# Altium schematic sheet MANEA_TCAD_PROIECT_Sheet2.SchDoc (part 2 of 3)
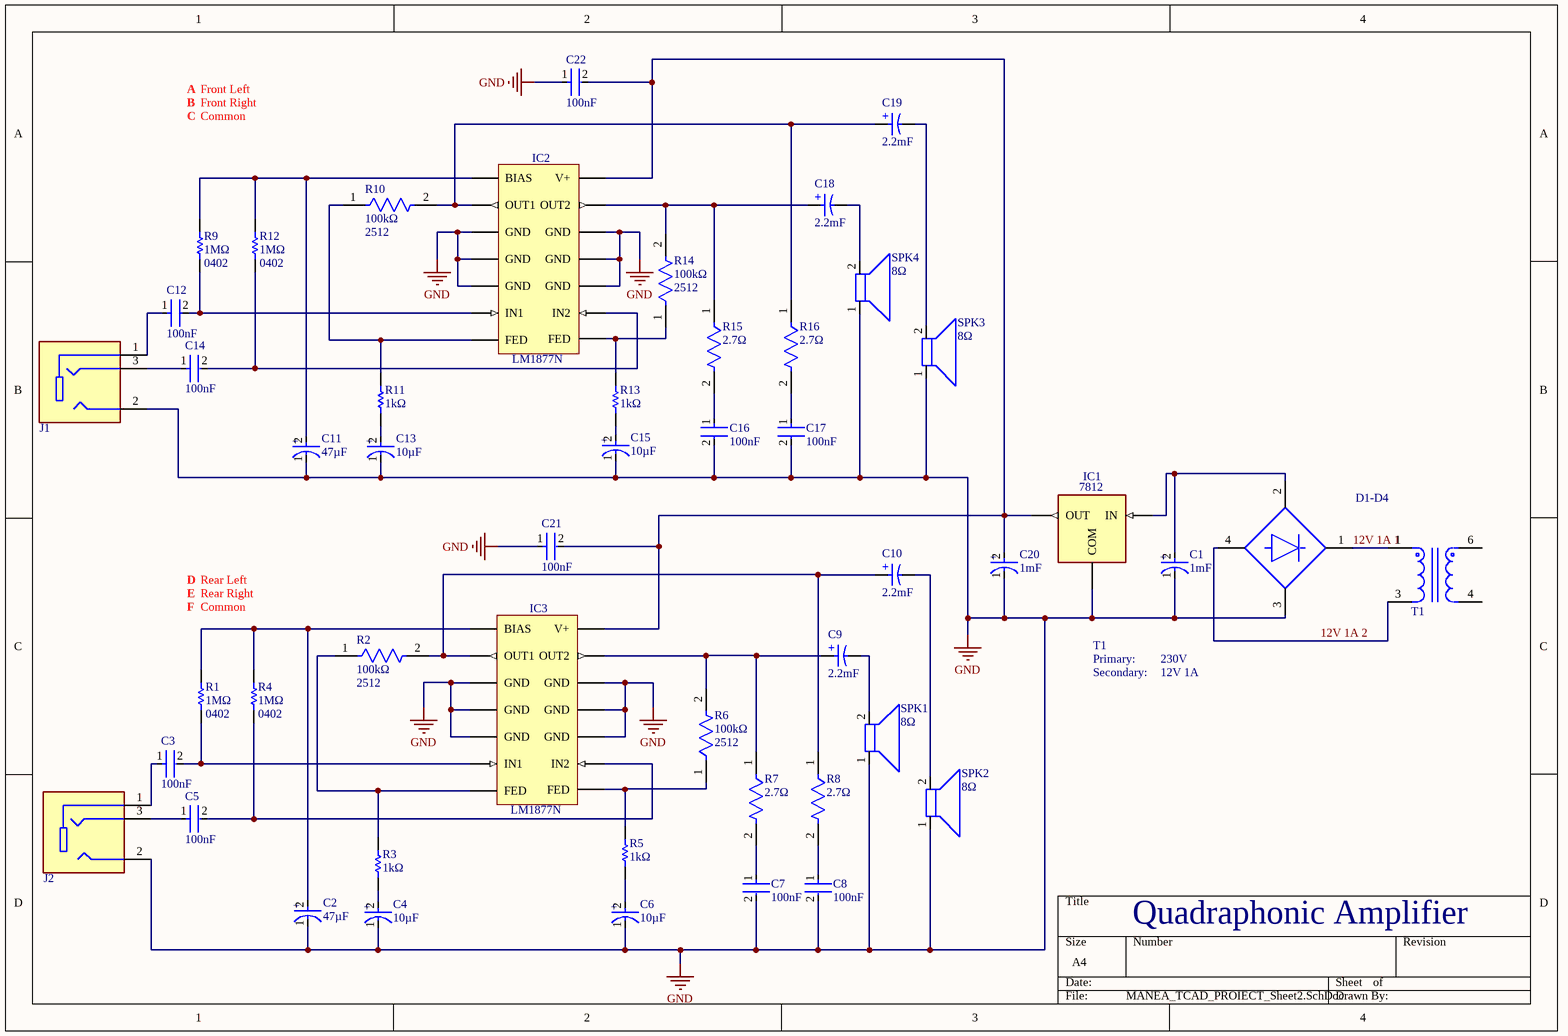
[diagram p1: MANEA_TCAD_PROIECT_Sheet2.SchDoc]
## Library data of the parts
C1 C20 = EEV-FK1H102M: Radial Can - SMD ALUMINUM ELECTROLYTIC CAPACITOR FK 50V 1000muF 卤20% 0.630Dia 16.00mm; Manufacturer: Panasonic; Manufacturer Lifecycle Status: ACTIVE; Dielectric Material: Aluminium; Dissipation Factor: 10%; ESR (Equivalent Series Resistance): 73mΩ; Leakage Current: 500µA; Life (Hours): 2000hours; Ripple Current: 1.61A; Tolerance: 20%; Supplier: DigiKey; Supplier Part Number: PCE3477CT-ND; Manufacturer Part Number: EEV-FK1H102M; RoHS: Compliant; Category: Aluminum Electrolytic Capacitors; Pricing: 1=2.17, 10=1.427, 50=1.1178 (USD); Contact Plating: Tin; Country of Origin: Japan, Malaysia; Diameter: 16mm; Export Control Classification Number (ECCN) Code: EAR99; Height: 16.5mm; Height - Seated (Max): 16.51mm; Impedance: 73mΩ; Introduction Date: 2001-12-07; Lead Free: Lead Free; Length: 16.5mm; Lifecycle Status: Production; Material: Aluminium; Max Operating Temperature: 105°C; Min Operating Temperature: -55°C; Mounting Technology: Surface Mount; Pins: 2; Number of Terminals: 2; Packaging: Cut Tape; Radiation Hardening: No; REACH SVHC: Yes; Ripple Current (AC): 1.61A; Schedule B: 8532220020; Part Series: FK; Termination: SMD/SMT; Voltage: 50V; Voltage Rating: 50V; Voltage Rating (AC): 50V; Voltage Rating (DC): 50V; Width: 17mm; ComponentLink1URL: https://datasheet.octopart.com:443/EEV-FK1H102M-Panasonic-datasheet-138897395.pdf?src-supplier=Upverter; ComponentLink1Description: https://datasheet.octopart.com:443/EEV-FK1H102M-Panasonic-datasheet-138897395.pdf?src-supplier=Upverter; ComponentLink2URL: https://datasheet.octopart.com:443/EEV-FK1H102M-Panasonic-datasheet-62287436.pdf?src-supplier=Panasonic; ComponentLink2Description: https://datasheet.octopart.com:443/EEV-FK1H102M-Panasonic-datasheet-62287436.pdf?src-supplier=Panasonic; ComponentLink3URL: https://datasheet.octopart.com:443/EEV-FK1H102M-Panasonic-datasheet-13266987.pdf?src-supplier=Newark; ComponentLink3Description: https://datasheet.octopart.com:443/EEV-FK1H102M-Panasonic-datasheet-13266987.pdf?src-supplier=Newark; ComponentLink4URL: https://datasheet.octopart.com:443/EEV-FK1H102M-Panasonic-datasheet-61627622.pdf?src-supplier=Newark; ComponentLink4Description: https://datasheet.octopart.com:443/EEV-FK1H102M-Panasonic-datasheet-61627622.pdf?src-supplier=Newark; ComponentLink5URL: https://datasheet.octopart.com:443/EEV-FK1H102M-Panasonic-datasheet-8854493.pdf?src-supplier=Farnell; ComponentLink5Description: https://datasheet.octopart.com:443/EEV-FK1H102M-Panasonic-datasheet-8854493.pdf?src-supplier=Farnell; ComponentLink6URL: https://datasheet.octopart.com:443/EEV-FK1H102M-Panasonic-datasheet-8711795.pdf?src-supplier=Farnell; ComponentLink6Description: https://datasheet.octopart.com:443/EEV-FK1H102M-Panasonic-datasheet-8711795.pdf?src-supplier=Farnell; ComponentLink7URL: https://datasheet.octopart.com:443/EEV-FK1H102M-Panasonic-datasheet-5313801.pdf?src-supplier=Farnell; ComponentLink7Description: https://datasheet.octopart.com:443/EEV-FK1H102M-Panasonic-datasheet-5313801.pdf?src-supplier=Farnell; ComponentLink8URL: https://datasheet.octopart.com:443/EEVFK1H102M-Panasonic-datasheet-7555708.pdf?src-supplier=Farnell; ComponentLink8Description: https://datasheet.octopart.com:443/EEVFK1H102M-Panasonic-datasheet-7555708.pdf?src-supplier=Farnell; ComponentLink9URL: https://datasheet.octopart.com:443/EEVFK1H102M-Panasonic-datasheet-5318435.pdf?src-supplier=Farnell; ComponentLink9Description: https://datasheet.octopart.com:443/EEVFK1H102M-Panasonic-datasheet-5318435.pdf?src-supplier=Farnell; ComponentLink10URL: https://datasheet.octopart.com:443/EEVFK1H102M-Panasonic-datasheet-5316599.pdf?src-supplier=Farnell; ComponentLink10Description: https://datasheet.octopart.com:443/EEVFK1H102M-Panasonic-datasheet-5316599.pdf?src-supplier=Farnell; ComponentLink11URL: https://datasheet.octopart.com:443/EEVFK1H102M-Panasonic-datasheet-5390910.pdf?src-supplier=Farnell; ComponentLink11Description: https://datasheet.octopart.com:443/EEVFK1H102M-Panasonic-datasheet-5390910.pdf?src-supplier=Farnell; ComponentLink12URL: https://datasheet.octopart.com:443/EEVFK1H102M-Panasonic-datasheet-7550061.pdf?src-supplier=Farnell; ComponentLink12Description: https://datasheet.octopart.com:443/EEVFK1H102M-Panasonic-datasheet-7550061.pdf?src-supplier=Farnell; ComponentLink13URL: https://datasheet.octopart.com:443/EEVFK1H102M-Panasonic-datasheet-1770.pdf?src-supplier=Farnell; ComponentLink13Description: https://datasheet.octopart.com:443/EEVFK1H102M-Panasonic-datasheet-1770.pdf?src-supplier=Farnell; ComponentLink14URL: https://datasheet.octopart.com:443/EEVFK1H102M-Panasonic-datasheet-1290.pdf?src-supplier=Farnell; ComponentLink14Description: https://datasheet.octopart.com:443/EEVFK1H102M-Panasonic-datasheet-1290.pdf?src-supplier=Farnell; ComponentLink15URL: https://datasheet.octopart.com:443/EEVFK1H102M-Panasonic-datasheet-2601.pdf?src-supplier=Farnell; ComponentLink15Description: https://datasheet.octopart.com:443/EEVFK1H102M-Panasonic-datasheet-2601.pdf?src-supplier=Farnell; ComponentLink16URL: https://datasheet.octopart.com:443/EEVFK1H102M-Panasonic-datasheet-122249.pdf?src-supplier=Farnell; ComponentLink16Description: https://datasheet.octopart.com:443/EEVFK1H102M-Panasonic-datasheet-122249.pdf?src-supplier=Farnell; ComponentLink17URL: https://datasheet.octopart.com:443/EEVFK1H102M-Panasonic-datasheet-4056.pdf?src-supplier=Farnell; ComponentLink17Description: https://datasheet.octopart.com:443/EEVFK1H102M-Panasonic-datasheet-4056.pdf?src-supplier=Farnell; ComponentLink18URL: https://datasheet.octopart.com:443/EEV-FK1H102M-Panasonic-datasheet-8161.pdf?src-supplier=element14; ComponentLink18Description: https://datasheet.octopart.com:443/EEV-FK1H102M-Panasonic-datasheet-8161.pdf?src-supplier=element14; ComponentLink19URL: https://datasheet.octopart.com:443/EEV-FK1H102M-Panasonic-datasheet-150469824.pdf?src-supplier=Master+Electronics; ComponentLink19Description: https://datasheet.octopart.com:443/EEV-FK1H102M-Panasonic-datasheet-150469824.pdf?src-supplier=Master+Electronics; ComponentLink20URL: https://sigma.octopart.com:443/150570760/technical_drawing/Panasonic-EEVFK1H102M.pdf?src-supplier=Panasonic+SCT; ComponentLink20Description: https://sigma.octopart.com:443/150570760/technical_drawing/Panasonic-EEVFK1H102M.pdf?src-supplier=Panasonic+SCT; ComponentLink21URL: https://datasheet.octopart.com:443/EEVFK1H102M-Panasonic-datasheet-136531309.pdf?src-supplier=TME; ComponentLink21Description: https://datasheet.octopart.com:443/EEVFK1H102M-Panasonic-datasheet-136531309.pdf?src-supplier=TME; ComponentLink22URL: https://datasheet.octopart.com:443/EEVFK1H102M-Panasonic-datasheet-11546739.pdf?src-supplier=TME; ComponentLink22Description: https://datasheet.octopart.com:443/EEVFK1H102M-Panasonic-datasheet-11546739.pdf?src-supplier=TME; ComponentLink23URL: https://datasheet.octopart.com:443/EEVFK1H102M-Panasonic-datasheet-5315649.pdf?src-supplier=Verical; ComponentLink23Description: https://datasheet.octopart.com:443/EEVFK1H102M-Panasonic-datasheet-5315649.pdf?src-supplier=Verical; ComponentLink24URL: https://datasheet.octopart.com:443/EEVFK1H102M-Panasonic-datasheet-13275731.pdf?src-supplier=Verical; ComponentLink24Description: https://datasheet.octopart.com:443/EEVFK1H102M-Panasonic-datasheet-13275731.pdf?src-supplier=Verical; ComponentLink25URL: https://datasheet.octopart.com:443/EEV-FK1H102M-Panasonic-datasheet-48.pdf?src-supplier=DigiKey; ComponentLink25Description: https://datasheet.octopart.com:443/EEV-FK1H102M-Panasonic-datasheet-48.pdf?src-supplier=DigiKey; ComponentLink26URL: https://datasheet.octopart.com:443/EEV-FK1H102M-Panasonic-datasheet-122143.pdf?src-supplier=Electro+Sonic; ComponentLink26Description: https://datasheet.octopart.com:443/EEV-FK1H102M-Panasonic-datasheet-122143.pdf?src-supplier=Electro+Sonic; Case/Package: Radial; Stock: 6943
C2 C11 = EDH476M050S9HAA: Radial Can - SMD ALUMINUM ELECTROLYTIC CAPACITOR EDH 50V 47muF ±20% 0.248Dia 6.30mm; Manufacturer: Yageo Group; Dissipation Factor: 12%; Leakage Current: 23.5µA; Life (Hours): 2000hours; Ripple Current: 110mA; Supplier: DigiKey; Supplier Part Number: 399-EDH476M050S9HAACT-ND; Manufacturer Part Number: EDH476M050S9HAA; RoHS: Compliant; Category: Aluminum Electrolytic Capacitors; Pricing: 1=0.48, 10=0.298, 50=0.2202, 100=0.1954, 500=0.1527 (USD); Diameter: 6.3mm; Export Control Classification Number (ECCN) Code: EAR99; Height: 7.7mm; Harmonized Tariff Schedule (HTS) Code: 8532.22.00.20; Introduction Date: 2016-12-02; Length: 6.6mm; Lifecycle Status: Production; Max Operating Temperature: 105°C; Min Operating Temperature: -40°C; Mounting Technology: Surface Mount; Number of Terminals: 2; REACH SVHC: Yes; Tolerance: 20%; Voltage Rating: 50V; Voltage Rating (DC): 50V; Width: 6.6mm; ComponentLink1URL: https://datasheet.octopart.com:443/EDH476M050S9HAA-KEMET-datasheet-182055805.pdf?src-supplier=IHS; ComponentLink1Description: https://datasheet.octopart.com:443/EDH476M050S9HAA-KEMET-datasheet-182055805.pdf?src-supplier=IHS; ComponentLink2URL: https://datasheet.octopart.com:443/EDH476M050S9HAA-KEMET-datasheet-164311313.pdf?src-supplier=Upverter; ComponentLink2Description: https://datasheet.octopart.com:443/EDH476M050S9HAA-KEMET-datasheet-164311313.pdf?src-supplier=Upverter; ComponentLink3URL: https://datasheet.octopart.com:443/EDH476M050S9HAA-KEMET-datasheet-182000736.pdf?src-supplier=Farnell; ComponentLink3Description: https://datasheet.octopart.com:443/EDH476M050S9HAA-KEMET-datasheet-182000736.pdf?src-supplier=Farnell; ComponentLink4URL: https://datasheet.octopart.com:443/EDH476M050S9HAA-KEMET-datasheet-182000735.pdf?src-supplier=Farnell; ComponentLink4Description: https://datasheet.octopart.com:443/EDH476M050S9HAA-KEMET-datasheet-182000735.pdf?src-supplier=Farnell; ComponentLink5URL: https://datasheet.octopart.com:443/EDH476M050S9HAA-KEMET-datasheet-176335142.pdf?src-supplier=Newark; ComponentLink5Description: https://datasheet.octopart.com:443/EDH476M050S9HAA-KEMET-datasheet-176335142.pdf?src-supplier=Newark; ComponentLink6URL: https://datasheet.octopart.com:443/EDH476M050S9HAA-KEMET-datasheet-188904359.pdf?src-supplier=TME; ComponentLink6Description: https://datasheet.octopart.com:443/EDH476M050S9HAA-KEMET-datasheet-188904359.pdf?src-supplier=TME; Stock: 14614
C3 C5 C7 C8 C12 C14 C16 C17 C21 C22 = CC0603KRX7R9BB104: Multilayer Ceramic Capacitor, CC Series, 0.1 - F, - 10%, X7R, 50 V, 0603 [1608 Metric]; Manufacturer: Yageo Group; Voltage: 50V; Supplier: Farnell; Supplier Part Number: CC0603KRX7R9BB104; Manufacturer Part Number: CC0603KRX7R9BB104; RoHS: Compliant; Category: Ceramic Capacitors; Stock: 1047442; Pricing: 10=10, 100=0.06, 500=0.06, 1000=0.05, 2000=0.05, 4000=0.04 (EUR); Case/Package: 0603; Case Code (Imperial): 0603; Case Code (Metric): 1608; China RoHS: Compliant; Country of Origin: Mainland China, Taiwan; Depth: 800µm; Dielectric: X7R; Dielectric Material: Ceramic; Export Control Classification Number (ECCN) Code: EAR99; Halogen Free: Halogen Free; Height: 800µm; Harmonized Tariff Schedule (HTS) Code: 8532.24.00.20; Introduction Date: 2005-08-18; Lead Free: Lead Free; Length: 1.6mm; Lifecycle Status: Production; Material: Ceramic; Max Operating Temperature: 125°C; Min Operating Temperature: -55°C; Mounting Technology: Surface Mount; Pins: 2; Number of Terminals: 2; Radiation Hardening: No; REACH SVHC: Yes; Schedule B: 8532240020, 8532240020|8532240020, 8532240020|8532240020|8532240020, 8532240020|8532240020|8532240020|8532240020; Termination: SMD/SMT; Thickness: 889µm; Tolerance: 10%; Voltage Rating: 50V; Voltage Rating (DC): 50V; Width: 800µm; ComponentLink1URL: https://datasheet.octopart.com:443/CC0603KRX7R9BB104-Yageo-datasheet-177165144.pdf?src-supplier=IHS; ComponentLink1Description: https://datasheet.octopart.com:443/CC0603KRX7R9BB104-Yageo-datasheet-177165144.pdf?src-supplier=IHS; ComponentLink2URL: https://datasheet.octopart.com:443/CC0603KRX7R9BB104-Yageo-datasheet-82288757.pdf?src-supplier=Upverter; ComponentLink2Description: https://datasheet.octopart.com:443/CC0603KRX7R9BB104-Yageo-datasheet-82288757.pdf?src-supplier=Upverter; ComponentLink3URL: https://datasheet.octopart.com:443/CC0603KRX7R9BB104-Yageo-datasheet-68298032.pdf?src-supplier=Upverter; ComponentLink3Description: https://datasheet.octopart.com:443/CC0603KRX7R9BB104-Yageo-datasheet-68298032.pdf?src-supplier=Upverter; ComponentLink4URL: https://datasheet.octopart.com:443/CC0603KRX7R9BB104-Yageo-Group-datasheet-189192896.pdf?src-supplier=Future+Electronics; ComponentLink4Description: https://datasheet.octopart.com:443/CC0603KRX7R9BB104-Yageo-Group-datasheet-189192896.pdf?src-supplier=Future+Electronics; ComponentLink5URL: https://datasheet.octopart.com:443/CC0603KRX7R9BB104-Yageo-datasheet-12526321.pdf?src-supplier=Future+Electronics; ComponentLink5Description: https://datasheet.octopart.com:443/CC0603KRX7R9BB104-Yageo-datasheet-12526321.pdf?src-supplier=Future+Electronics; ComponentLink6URL: https://datasheet.octopart.com:443/CC0603KRX7R9BB104-Yageo-datasheet-166511530.pdf?src-supplier=Future+Electronics; ComponentLink6Description: https://datasheet.octopart.com:443/CC0603KRX7R9BB104-Yageo-datasheet-166511530.pdf?src-supplier=Future+Electronics; ComponentLink7URL: https://datasheet.octopart.com:443/CC0603KRX7R9BB104-Yageo-datasheet-137700082.pdf?src-supplier=Future+Electronics; ComponentLink7Description: https://datasheet.octopart.com:443/CC0603KRX7R9BB104-Yageo-datasheet-137700082.pdf?src-supplier=Future+Electronics; ComponentLink8URL: https://datasheet.octopart.com:443/CC0603KRX7R9BB104-Yageo-datasheet-137700084.pdf?src-supplier=Future+Electronics; ComponentLink8Description: https://datasheet.octopart.com:443/CC0603KRX7R9BB104-Yageo-datasheet-137700084.pdf?src-supplier=Future+Electronics; ComponentLink9URL: https://datasheet.octopart.com:443/CC0603KRX7R9BB104-Yageo-datasheet-27626582.pdf?src-supplier=Future+Electronics; ComponentLink9Description: https://datasheet.octopart.com:443/CC0603KRX7R9BB104-Yageo-datasheet-27626582.pdf?src-supplier=Future+Electronics; ComponentLink10URL: https://datasheet.octopart.com:443/CC0603KRX7R9BB104-Yageo-datasheet-15895757.pdf?src-supplier=Future+Electronics; ComponentLink10Description: https://datasheet.octopart.com:443/CC0603KRX7R9BB104-Yageo-datasheet-15895757.pdf?src-supplier=Future+Electronics; ComponentLink11URL: https://datasheet.octopart.com:443/CC0603KRX7R9BB104-Yageo-datasheet-8324192.pdf?src-supplier=Future+Electronics; ComponentLink11Description: https://datasheet.octopart.com:443/CC0603KRX7R9BB104-Yageo-datasheet-8324192.pdf?src-supplier=Future+Electronics; ComponentLink12URL: https://datasheet.octopart.com/CC0603KRX7R9BB104-Yageo-datasheet-10883670.pdf; ComponentLink12Description: https://datasheet.octopart.com/CC0603KRX7R9BB104-Yageo-datasheet-10883670.pdf; ComponentLink13URL: https://datasheet.octopart.com:443/CC0603KRX7R9BB104-Yageo-datasheet-181968726.pdf?src-supplier=Newark; ComponentLink13Description: https://datasheet.octopart.com:443/CC0603KRX7R9BB104-Yageo-datasheet-181968726.pdf?src-supplier=Newark; ComponentLink14URL: https://datasheet.octopart.com:443/CC0603KRX7R9BB104-Yageo-datasheet-499490.pdf?src-supplier=Newark; ComponentLink14Description: https://datasheet.octopart.com:443/CC0603KRX7R9BB104-Yageo-datasheet-499490.pdf?src-supplier=Newark; ComponentLink15URL: https://datasheet.octopart.com:443/CC0603KRX7R9BB104-Yageo-datasheet-62336348.pdf?src-supplier=Newark; ComponentLink15Description: https://datasheet.octopart.com:443/CC0603KRX7R9BB104-Yageo-datasheet-62336348.pdf?src-supplier=Newark; ComponentLink16URL: https://datasheet.octopart.com:443/CC0603KRX7R9BB104-Yageo-datasheet-147453679.pdf?src-supplier=Newark; ComponentLink16Description: https://datasheet.octopart.com:443/CC0603KRX7R9BB104-Yageo-datasheet-147453679.pdf?src-supplier=Newark; ComponentLink17URL: https://datasheet.octopart.com:443/CC0603KRX7R9BB104-Yageo-datasheet-151948686.pdf?src-supplier=Farnell; ComponentLink17Description: https://datasheet.octopart.com:443/CC0603KRX7R9BB104-Yageo-datasheet-151948686.pdf?src-supplier=Farnell; ComponentLink18URL: https://datasheet.octopart.com:443/CC0603KRX7R9BB104-Yageo-datasheet-500777.pdf?src-supplier=Farnell; ComponentLink18Description: https://datasheet.octopart.com:443/CC0603KRX7R9BB104-Yageo-datasheet-500777.pdf?src-supplier=Farnell; ComponentLink19URL: https://datasheet.octopart.com:443/CC0603KRX7R9BB104-Yageo-datasheet-178019014.pdf?src-supplier=Burklin+Elektronik; ComponentLink19Description: https://datasheet.octopart.com:443/CC0603KRX7R9BB104-Yageo-datasheet-178019014.pdf?src-supplier=Burklin+Elektronik; ComponentLink20URL: https://datasheet.octopart.com:443/CC0603KRX7R9BB104-Yageo-Group-datasheet-165992755.pdf?src-supplier=ODG+(Origin+Data+Global); ComponentLink20Description: https://datasheet.octopart.com:443/CC0603KRX7R9BB104-Yageo-Group-datasheet-165992755.pdf?src-supplier=ODG+(Origin+Data+Global); ComponentLink21URL: https://datasheet.octopart.com:443/CC0603KRX7R9BB104-Yageo-datasheet-140260305.pdf?src-supplier=SOS+electronic; ComponentLink21Description: https://datasheet.octopart.com:443/CC0603KRX7R9BB104-Yageo-datasheet-140260305.pdf?src-supplier=SOS+electronic; ComponentLink22URL: https://datasheet.octopart.com:443/CC0603KRX7R9BB104-Yageo-datasheet-120101875.pdf?src-supplier=Megastar; ComponentLink22Description: https://datasheet.octopart.com:443/CC0603KRX7R9BB104-Yageo-datasheet-120101875.pdf?src-supplier=Megastar; ComponentLink23URL: https://datasheet.octopart.com:443/CC0603KRX7R9BB104-Yageo-datasheet-8701427.pdf?src-supplier=element14; ComponentLink23Description: https://datasheet.octopart.com:443/CC0603KRX7R9BB104-Yageo-datasheet-8701427.pdf?src-supplier=element14; ComponentLink24URL: https://datasheet.octopart.com:443/CC0603KRX7R9BB104-Yageo-datasheet-5301394.pdf?src-supplier=element14; ComponentLink24Description: https://datasheet.octopart.com:443/CC0603KRX7R9BB104-Yageo-datasheet-5301394.pdf?src-supplier=element14; ComponentLink25URL: https://datasheet.octopart.com:443/CC0603KRX7R9BB104-Yageo-datasheet-17600895.pdf?src-supplier=TME; ComponentLink25Description: https://datasheet.octopart.com:443/CC0603KRX7R9BB104-Yageo-datasheet-17600895.pdf?src-supplier=TME; ComponentLink26URL: http://sigma.octopart.com:80/15889575/rohs_statement/Yageo-CC0603KRX7R9BB104.pdf?src-supplier=Compliance+Statements; ComponentLink26Description: http://sigma.octopart.com:80/15889575/rohs_statement/Yageo-CC0603KRX7R9BB104.pdf?src-supplier=Compliance+Statements; ComponentLink27URL: http://sigma.octopart.com:80/conflict_mineral_statement/Yageo-company-3.pdf?src-supplier=Compliance+Statements; ComponentLink27Description: http://sigma.octopart.com:80/conflict_mineral_statement/Yageo-company-3.pdf?src-supplier=Compliance+Statements
C4 C6 C13 C15 = EEEFP1C100AR: Capacitor Aluminum 10uF 16VDC 20% 4 X 5.8mm SMD 0.85 Ohm 160mA 2000 hr Embossed T/R; Manufacturer: Panasonic; Manufacturer Lifecycle Status: ACTIVE; Part Series: FP (High temp. reflow); Dissipation Factor: 16%; ESR (Equivalent Series Resistance): 850mΩ; Leakage Current: 3µA; Life (Hours): 2000hours; Material: Aluminium; Voltage: 16V; Supplier: Farnell; Supplier Part Number: EEEFP1C100AR; Manufacturer Part Number: EEEFP1C100AR; RoHS: Compliant; Category: Aluminum Electrolytic Capacitors; Stock: 40000; Pricing: 2000=2000 (EUR); Case/Package: Radial; Contact Plating: Tin; Country of Origin: Japan, Malaysia; Diameter: 4mm; Export Control Classification Number (ECCN) Code: EAR99; Features: High Temperature; Height: 5.8mm; Height - Seated (Max): 5.7912mm; Harmonized Tariff Schedule (HTS) Code: 8532.22.00.20; Introduction Date: 2008-03-04; Lead Free: Lead Free; Lead Pitch: 1mm; Length: 5.8mm; Lifecycle Status: Production; Max Operating Temperature: 105°C; Min Operating Temperature: -55°C; Mounting Technology: Surface Mount; Pins: 2; Number of Terminals: 2; Packaging: Cut Tape; Radiation Hardening: No; REACH SVHC: Yes; Ripple Current: 160mA; Ripple Current (AC): 160mA; Schedule B: 8532220020, 8532220020|8532220020, 8532220020|8532220020|8532220020, 8532220020|8532220020|8532220020|8532220020; Termination: SMD/SMT; Tolerance: 20%; Voltage Rating: 16V; Voltage Rating (DC): 16V; Width: 4.3mm; ComponentLink1URL: https://datasheet.octopart.com:443/EEEFP1C100AR-Panasonic-datasheet-182100943.pdf?src-supplier=IHS; ComponentLink1Description: https://datasheet.octopart.com:443/EEEFP1C100AR-Panasonic-datasheet-182100943.pdf?src-supplier=IHS; ComponentLink2URL: https://datasheet.octopart.com:443/EEEFP1C100AR-Panasonic-datasheet-66433925.pdf?src-supplier=Future+Electronics; ComponentLink2Description: https://datasheet.octopart.com:443/EEEFP1C100AR-Panasonic-datasheet-66433925.pdf?src-supplier=Future+Electronics; ComponentLink3URL: https://datasheet.octopart.com:443/EEEFP1C100AR-Panasonic-datasheet-5402830.pdf?src-supplier=Future+Electronics; ComponentLink3Description: https://datasheet.octopart.com:443/EEEFP1C100AR-Panasonic-datasheet-5402830.pdf?src-supplier=Future+Electronics; ComponentLink4URL: https://datasheet.octopart.com:443/EEEFP1C100AR-Panasonic-datasheet-10533123.pdf?src-supplier=Future+Electronics; ComponentLink4Description: https://datasheet.octopart.com:443/EEEFP1C100AR-Panasonic-datasheet-10533123.pdf?src-supplier=Future+Electronics; ComponentLink5URL: https://datasheet.octopart.com:443/EEEFP1C100AR-Panasonic-datasheet-8835375.pdf?src-supplier=Future+Electronics; ComponentLink5Description: https://datasheet.octopart.com:443/EEEFP1C100AR-Panasonic-datasheet-8835375.pdf?src-supplier=Future+Electronics; ComponentLink6URL: https://datasheet.octopart.com:443/EEEFP1C100AR-Panasonic-datasheet-13268972.pdf?src-supplier=Electro+Sonic; ComponentLink6Description: https://datasheet.octopart.com:443/EEEFP1C100AR-Panasonic-datasheet-13268972.pdf?src-supplier=Electro+Sonic; ComponentLink7URL: https://datasheet.octopart.com:443/EEEFP1C100AR-Panasonic-datasheet-43765692.pdf?src-supplier=Electro+Sonic; ComponentLink7Description: https://datasheet.octopart.com:443/EEEFP1C100AR-Panasonic-datasheet-43765692.pdf?src-supplier=Electro+Sonic; ComponentLink8URL: https://datasheet.octopart.com:443/EEE-FP1C100AR-Panasonic-datasheet-27908621.pdf?src-supplier=Electro+Sonic; ComponentLink8Description: https://datasheet.octopart.com:443/EEE-FP1C100AR-Panasonic-datasheet-27908621.pdf?src-supplier=Electro+Sonic; ComponentLink9URL: https://datasheet.octopart.com:443/EEE-FP1C100AR-Panasonic-datasheet-154766120.pdf?src-supplier=JRH+Electronics; ComponentLink9Description: https://datasheet.octopart.com:443/EEE-FP1C100AR-Panasonic-datasheet-154766120.pdf?src-supplier=JRH+Electronics; ComponentLink10URL: https://datasheet.octopart.com:443/EEEFP1C100AR-Panasonic-datasheet-178895083.pdf?src-supplier=Burklin+Elektronik; ComponentLink10Description: https://datasheet.octopart.com:443/EEEFP1C100AR-Panasonic-datasheet-178895083.pdf?src-supplier=Burklin+Elektronik; ComponentLink11URL: https://sigma.octopart.com:443/150570760/technical_drawing/Panasonic-EEEFP1C100AR.pdf?src-supplier=Panasonic+SCT; ComponentLink11Description: https://sigma.octopart.com:443/150570760/technical_drawing/Panasonic-EEEFP1C100AR.pdf?src-supplier=Panasonic+SCT; ComponentLink12URL: https://datasheet.octopart.com:443/EEEFP1C100AR-Panasonic-datasheet-5301681.pdf?src-supplier=Farnell; ComponentLink12Description: https://datasheet.octopart.com:443/EEEFP1C100AR-Panasonic-datasheet-5301681.pdf?src-supplier=Farnell
C9 C10 C18 C19 = 865080463017: SMD Aluminium Electrolytic Capacitor, WCAP-ASLI Series, 2200 F, 25 V, Radial Can - SMD, 16 mm; Manufacturer: Wurth Elektronik; ESR (Equivalent Series Resistance): 40.2412mΩ; Impedance: 52mΩ; Insulation Resistance: 45.4545kΩ; Leakage Current: 550µA; Life (Hours): 2000hours; Polarity: Polar; Ripple Current: 1.25A; Tolerance: 20%; Voltage Rating: 25V; Supplier: DigiKey; Supplier Part Number: 732-8445-1-ND; Manufacturer Part Number: 865080463017; RoHS: Compliant; Category: Aluminum Electrolytic Capacitors; Stock: 101; Pricing: 1=3.83, 50=3.268 (USD); Case/Package: Radial; Diameter: 16mm; Height: 17mm; Height - Seated (Max): 16.9926mm; Length: 17mm; Max Operating Temperature: 105°C; Min Operating Temperature: -55°C; Mounting Technology: Surface Mount; REACH SVHC: Unknown; Ripple Current (AC): 1.25A; Voltage Rating (DC): 25V; Width: 17.1mm; ComponentLink1URL: https://datasheet.octopart.com:443/865080463017-Wurth-Elektronik-datasheet-168508426.pdf?src-supplier=Wurth+Elektronik; ComponentLink1Description: https://datasheet.octopart.com:443/865080463017-Wurth-Elektronik-datasheet-168508426.pdf?src-supplier=Wurth+Elektronik; ComponentLink2URL: https://datasheet.octopart.com:443/865080463017-W%C3%BCrth-Elektronik-datasheet-37144410.pdf?src-supplier=Newark; ComponentLink2Description: https://datasheet.octopart.com:443/865080463017-W%C3%BCrth-Elektronik-datasheet-37144410.pdf?src-supplier=Newark
D1-D4 = VS-36MB160A: Diode, Bridge Rectifier, Vr 1600V, If 35A, Pkg D-34, Vf 1.3V, VS-36MB Series; Manufacturer: Vishay; Element Configuration: Single; Max Forward Surge Current (Ifsm): 500A; Max Repetitive Reverse Voltage (Vrrm): 1.6kV; Max Surge Current: 155A; Nominal Supply Voltage: 1.13kV; Number of Elements: 4; Peak Reverse Current: 10µA; Supplier: Farnell; Supplier Part Number: VS-36MB160A; Manufacturer Part Number: VS-36MB160A; RoHS: Compliant; Category: Bridge Rectifier Diodes; Stock: 238; Pricing: 1=1, 5=55.37, 10=40.64, 50=39.37, 100=38.05, 250=37.29 (EUR); Case/Package: D; Contact Plating: Nickel; Export Control Classification Number (ECCN) Code: EAR99; Forward Current: 35A; Forward Voltage: 1.3V; Height: 9.8mm; Harmonized Tariff Schedule (HTS) Code: 8541.10.00.80; Introduction Date: 2013-10-29; Length: 28.5mm; Lifecycle Status: Production; Max Operating Temperature: 150°C; Max Output current: 35A; Min Operating Temperature: -55°C; Mounting Technology: Screw, Through Hole; Pins: 4; Number of Terminals: 4; Peak Non-Repetitive Surge Current: 500A; Radiation Hardening: No; REACH SVHC: No; Reverse Standoff Voltage: 1.6kV; Weight: 19.999993g; ComponentLink1URL: https://datasheet.octopart.com:443/VS-36MB160A-Vishay-datasheet-167934344.pdf?src-supplier=Newark; ComponentLink1Description: https://datasheet.octopart.com:443/VS-36MB160A-Vishay-datasheet-167934344.pdf?src-supplier=Newark; ComponentLink2URL: https://datasheet.octopart.com:443/VS-36MB160A-Vishay-datasheet-34179020.pdf?src-supplier=Newark; ComponentLink2Description: https://datasheet.octopart.com:443/VS-36MB160A-Vishay-datasheet-34179020.pdf?src-supplier=Newark; ComponentLink3URL: https://datasheet.octopart.com:443/VS-36MB160A-Vishay-datasheet-105827.pdf?src-supplier=Newark; ComponentLink3Description: https://datasheet.octopart.com:443/VS-36MB160A-Vishay-datasheet-105827.pdf?src-supplier=Newark; ComponentLink4URL: https://datasheet.octopart.com:443/VS-36MB160A-Vishay-datasheet-78835536.pdf?src-supplier=element14+APAC; ComponentLink4Description: https://datasheet.octopart.com:443/VS-36MB160A-Vishay-datasheet-78835536.pdf?src-supplier=element14+APAC; ComponentLink5URL: https://datasheet.octopart.com:443/VS-36MB160A-Vishay-datasheet-62319662.pdf?src-supplier=element14+APAC; ComponentLink5Description: https://datasheet.octopart.com:443/VS-36MB160A-Vishay-datasheet-62319662.pdf?src-supplier=element14+APAC; ComponentLink6URL: https://datasheet.octopart.com:443/VS-36MB160A-Vishay-datasheet-21423584.pdf?src-supplier=Farnell; ComponentLink6Description: https://datasheet.octopart.com:443/VS-36MB160A-Vishay-datasheet-21423584.pdf?src-supplier=Farnell; ComponentLink7URL: https://datasheet.octopart.com:443/VS-36MB160A-Vishay-datasheet-166790267.pdf?src-supplier=TME; ComponentLink7Description: https://datasheet.octopart.com:443/VS-36MB160A-Vishay-datasheet-166790267.pdf?src-supplier=TME; ComponentLink8URL: https://datasheet.octopart.com:443/VS-36MB160A-Vishay-datasheet-136158779.pdf?src-supplier=Future+Electronics; ComponentLink8Description: https://datasheet.octopart.com:443/VS-36MB160A-Vishay-datasheet-136158779.pdf?src-supplier=Future+Electronics; ComponentLink9URL: https://datasheet.octopart.com:443/VS-36MB160A-Vishay-datasheet-9661278.pdf?src-supplier=RS+(Formerly+Allied+Electronics); ComponentLink9Description: https://datasheet.octopart.com:443/VS-36MB160A-Vishay-datasheet-9661278.pdf?src-supplier=RS+(Formerly+Allied+Electronics); ComponentLink10URL: http://sigma.octopart.com:80/rohs_statement/Vishay-company-15.pdf?src-supplier=Compliance+Statements; ComponentLink10Description: http://sigma.octopart.com:80/rohs_statement/Vishay-company-15.pdf?src-supplier=Compliance+Statements
IC1 = LM7812: 1.5-A, 30-V, linear voltage regulator 3-DDPAK/TO-263 0 to 125
IC2 IC3 = LM1877N: LM1877 Buck Tape & Reel (TR) e3 DC to DC switching controller 400muA 6A 800mum 4.5V
J1 J2 = SJ1-3523N: 3.5 mm, Stereo, Right Angle, Through Hole, Audio Jack Connector; Manufacturer: Same Sky; Contact Resistance: 50mΩ; Current Rating: 1A; Insulation Resistance: 100MΩ; Number of Conductors: 3; Number of Ports: 1; Operating Force: 29.42N; Shielding: Unshielded; Voltage Rating: 12V; Supplier: Arrow Electronics; Supplier Part Number: SJ1-3523N; Manufacturer Part Number: SJ1-3523N; RoHS: Compliant; Category: Audio / Video Connectors; Stock: 4186; Pricing: 186=0.5385, 280=0.5263, 560=0.521, 1120=0.5158, 2520=0.5106 (USD); Contact Gender: Female; Export Control Classification Number (ECCN) Code: EAR99; Harmonized Tariff Schedule (HTS) Code: 8536.69.40.10; Introduction Date: 2013-12-05; Lifecycle Status: Production; Max Operating Temperature: 85°C; Min Operating Temperature: -25°C; Mounting Technology: Through Hole; Pins: 3; Number of Poles: 3; REACH SVHC: Yes; Shell Finish: Nickel; Shell Material: Brass; ComponentLink1URL: https://datasheet.octopart.com:443/SJ1-3523N-Same-Sky-datasheet-188842965.pdf?src-supplier=Same+Sky; ComponentLink1Description: https://datasheet.octopart.com:443/SJ1-3523N-Same-Sky-datasheet-188842965.pdf?src-supplier=Same+Sky; ComponentLink2URL: https://datasheet.octopart.com:443/SJ1-3523N-Same-Sky-datasheet-181919365.pdf?src-supplier=Same+Sky; ComponentLink2Description: https://datasheet.octopart.com:443/SJ1-3523N-Same-Sky-datasheet-181919365.pdf?src-supplier=Same+Sky; ComponentLink3URL: https://datasheet.octopart.com:443/SJ1-3523N-Same-Sky-datasheet-181919366.pdf?src-supplier=Same+Sky; ComponentLink3Description: https://datasheet.octopart.com:443/SJ1-3523N-Same-Sky-datasheet-181919366.pdf?src-supplier=Same+Sky; ComponentLink4URL: https://datasheet.octopart.com:443/SJ1-3523N-CUI-Devices-datasheet-175925037.pdf?src-supplier=Same+Sky; ComponentLink4Description: https://datasheet.octopart.com:443/SJ1-3523N-CUI-Devices-datasheet-175925037.pdf?src-supplier=Same+Sky; ComponentLink5URL: https://datasheet.octopart.com:443/SJ1-3523N-CUI-Devices-datasheet-137944680.pdf?src-supplier=Same+Sky; ComponentLink5Description: https://datasheet.octopart.com:443/SJ1-3523N-CUI-Devices-datasheet-137944680.pdf?src-supplier=Same+Sky; ComponentLink6URL: https://datasheet.octopart.com:443/SJ1-3523N-CUI-Devices-datasheet-180438157.pdf?src-supplier=IHS; ComponentLink6Description: https://datasheet.octopart.com:443/SJ1-3523N-CUI-Devices-datasheet-180438157.pdf?src-supplier=IHS; ComponentLink7URL: https://datasheet.octopart.com:443/SJ1-3523N-Same-Sky-datasheet-190142061.pdf?src-supplier=element14+APAC; ComponentLink7Description: https://datasheet.octopart.com:443/SJ1-3523N-Same-Sky-datasheet-190142061.pdf?src-supplier=element14+APAC; ComponentLink8URL: https://datasheet.octopart.com:443/SJ1-3523N-Same-Sky-datasheet-182881325.pdf?src-supplier=Electro+Sonic; ComponentLink8Description: https://datasheet.octopart.com:443/SJ1-3523N-Same-Sky-datasheet-182881325.pdf?src-supplier=Electro+Sonic; ComponentLink9URL: https://datasheet.octopart.com:443/SJ1-3523N-CUI-Devices-datasheet-103114031.pdf?src-supplier=Master+Electronics; ComponentLink9Description: https://datasheet.octopart.com:443/SJ1-3523N-CUI-Devices-datasheet-103114031.pdf?src-supplier=Master+Electronics; ComponentLink10URL: https://datasheet.octopart.com:443/SJ1-3523N-Same-Sky-datasheet-189105612.pdf?src-supplier=Master+Electronics; ComponentLink10Description: https://datasheet.octopart.com:443/SJ1-3523N-Same-Sky-datasheet-189105612.pdf?src-supplier=Master+Electronics; ComponentLink11URL: https://datasheet.octopart.com:443/SJ1-3523N-Same-Sky-datasheet-182050170.pdf?src-supplier=Future+Electronics; ComponentLink11Description: https://datasheet.octopart.com:443/SJ1-3523N-Same-Sky-datasheet-182050170.pdf?src-supplier=Future+Electronics; ComponentLink12URL: https://datasheet.octopart.com:443/SJ1-3523N-CUI-Devices-datasheet-179174321.pdf?src-supplier=Future+Electronics; ComponentLink12Description: https://datasheet.octopart.com:443/SJ1-3523N-CUI-Devices-datasheet-179174321.pdf?src-supplier=Future+Electronics; ComponentLink13URL: https://datasheet.octopart.com:443/SJ1-3523N-CUI-Devices-datasheet-175923655.pdf?src-supplier=Future+Electronics; ComponentLink13Description: https://datasheet.octopart.com:443/SJ1-3523N-CUI-Devices-datasheet-175923655.pdf?src-supplier=Future+Electronics; ComponentLink14URL: https://datasheet.octopart.com:443/SJ1-3523N-CUI-Devices-datasheet-137916565.pdf?src-supplier=Future+Electronics; ComponentLink14Description: https://datasheet.octopart.com:443/SJ1-3523N-CUI-Devices-datasheet-137916565.pdf?src-supplier=Future+Electronics; ComponentLink15URL: https://datasheet.octopart.com:443/SJ1-3523N-CUI-Devices-datasheet-175927865.pdf?src-supplier=CUI+Devices+SCT; ComponentLink15Description: https://datasheet.octopart.com:443/SJ1-3523N-CUI-Devices-datasheet-175927865.pdf?src-supplier=CUI+Devices+SCT; ComponentLink16URL: https://datasheet.octopart.com:443/SJ1-3523N-CUI-Devices-datasheet-142371563.pdf?src-supplier=CUI+Devices+SCT; ComponentLink16Description: https://datasheet.octopart.com:443/SJ1-3523N-CUI-Devices-datasheet-142371563.pdf?src-supplier=CUI+Devices+SCT; ComponentLink17URL: https://octopart.com:443/opatz8j6/c1?t=gjuFzP5FeJ83X9cwTGu2sEmmwJClMyKvRq31tK1ghiwMfaJiNfVooFEWA3NKcPKyVTi3TopjWN7_jVNemsgZYLBGcTysez8j3ooErhfGEpaGvYXTm46f2XKwF5AUrG3oakeW1EITrY-RgczLpEkf621pOmzGdcrBuo_fTY8P93EKEICRE_pTxQzimOUyEadwLjpAytiZue2sdnG9_08Nr5BHHxjjNOe--5RGBswLz9oJptexyQGuRjBmjD9nyt9tPx4AxWVkug0cZeRbY05jbZASdtPt6-WktcXXJ7Li33icjQZem-hXhaL2R0u0Af73md00k_u0irKwzPj4eC0junqs0zkurYeIpEBCFnbg&src-supplier=Compliance+Statements; ComponentLink17Description: https://octopart.com:443/opatz8j6/c1?t=gjuFzP5FeJ83X9cwTGu2sEmmwJClMyKvRq31tK1ghiwMfaJiNfVooFEWA3NKcPKyVTi3TopjWN7_jVNemsgZYLBGcTysez8j3ooErhfGEpaGvYXTm46f2XKwF5AUrG3oakeW1EITrY-RgczLpEkf621pOmzGdcrBuo_fTY8P93EKEICRE_pTxQzimOUyEadwLjpAytiZue2sdnG9_08Nr5BHHxjjNOe--5RGBswLz9oJptexyQGuRjBmjD9nyt9tPx4AxWVkug0cZeRbY05jbZASdtPt6-WktcXXJ7Li33icjQZem-hXhaL2R0u0Af73md00k_u0irKwzPj4eC0junqs0zkurYeIpEBCFnbg&src-supplier=Compliance+Statements; ComponentLink18URL: https://octopart.com:443/opatz8j6/c1?t=FK_WB5MEeg8e3hchiUFLufnmrXjWfPns_31GAxOxSz5XCu7Mx54RJmU8oWMVHzsQDHhVfL6sbpf8_NglWXW47YlrGWvjCIcYCwBgGax26lgPQP7ePVnUIuxTSbRF0WS-6Nsk4c6CYYrZ3tinGlSI5arQThC3cXIqlveG9Ik5qLNagbrnaAXootczi_mrI3vsNqx9WMqOLxXIFI4-vrFzhJlVucQLREwoWmYqkSPYLuQ3--heFvxW44gPWJaFS9ZBQLJofzqBGReJxXS-DgOgjl2bCuYmuX6dX4q51Wsnv4hQ3w_hAUVVOW1quancvtOtLktylFp-nv9BlBEi-vqz9ne94H7vkARog4eX&src-supplier=Compliance+Statements; ComponentLink18Description: https://octopart.com:443/opatz8j6/c1?t=FK_WB5MEeg8e3hchiUFLufnmrXjWfPns_31GAxOxSz5XCu7Mx54RJmU8oWMVHzsQDHhVfL6sbpf8_NglWXW47YlrGWvjCIcYCwBgGax26lgPQP7ePVnUIuxTSbRF0WS-6Nsk4c6CYYrZ3tinGlSI5arQThC3cXIqlveG9Ik5qLNagbrnaAXootczi_mrI3vsNqx9WMqOLxXIFI4-vrFzhJlVucQLREwoWmYqkSPYLuQ3--heFvxW44gPWJaFS9ZBQLJofzqBGReJxXS-DgOgjl2bCuYmuX6dX4q51Wsnv4hQ3w_hAUVVOW1quancvtOtLktylFp-nv9BlBEi-vqz9ne94H7vkARog4eX&src-supplier=Compliance+Statements; ComponentLink19URL: https://octopart.com:443/opatz8j6/c1?t=UdIpGBcksFMbyudDRCHU_cM4VUqfRdaD9F0GIXHSdxGioLaqUbbj5soB0Lg_i9Le1gzib9ZjKQgBK4iE-j6DgrULbk6LjM663-xmUcWGM4Ya9FvNt2cmxcyNinrQ5ZBPyY5bu4RoQeVMp19Io0LziUfQXBaMG81yX2Qgy7rm_o7yZdT82mfh7U3A6q7SJxIqB7I7ZbQfC5CabIjoAbjznbQrH1ozzyaeiQXVL_6geplWzkdIi5w2dHDvFVp-IGUN90e2klKnP2A_Ai5F6BLf3IjGe8Zjo2r6t-LDgqKHNYw3iDHugYaVHNcStOHFhZFC-2WwucY-mGkN9-fcAqr1fA9RpMNns50&src-supplier=Compliance+Statements; ComponentLink19Description: https://octopart.com:443/opatz8j6/c1?t=UdIpGBcksFMbyudDRCHU_cM4VUqfRdaD9F0GIXHSdxGioLaqUbbj5soB0Lg_i9Le1gzib9ZjKQgBK4iE-j6DgrULbk6LjM663-xmUcWGM4Ya9FvNt2cmxcyNinrQ5ZBPyY5bu4RoQeVMp19Io0LziUfQXBaMG81yX2Qgy7rm_o7yZdT82mfh7U3A6q7SJxIqB7I7ZbQfC5CabIjoAbjznbQrH1ozzyaeiQXVL_6geplWzkdIi5w2dHDvFVp-IGUN90e2klKnP2A_Ai5F6BLf3IjGe8Zjo2r6t-LDgqKHNYw3iDHugYaVHNcStOHFhZFC-2WwucY-mGkN9-fcAqr1fA9RpMNns50&src-supplier=Compliance+Statements; ComponentLink20URL: https://octopart.com:443/opatz8j6/c1?t=pDg1b1pYhpzqU392vJ_Jb3HLHPPzL0sAM5iyDHTPCetBcv_Sp1d-hJNQ556zVr5CdDNtNnZDeT9UXiVgAY5S64M-JSURvz-uorpDhlHE8t-NqIP0C6funSUuJTALTwKEJ_63uBUFx6mOoaK7PcASKHZ5FUs2Eanv8BS0GHxdibUAf2RceAXHkxwb2tLftSdnLjUq3WIVWvGyaOXA152k5sLcWrVPe37TXyhtlruGxJ-oGWaHmv_rm21DomcvISw5LsSS6OYGOZPVpG2uGYGgsGXwC0kLCw0NRQ_8r5isbCv0nrOWO727JWoEjEl5igJPqhucFWm0rj7fGTRzHNPtvFZjRbxEkRX6NoLHgIlI&src-supplier=Compliance+Statements; ComponentLink20Description: https://octopart.com:443/opatz8j6/c1?t=pDg1b1pYhpzqU392vJ_Jb3HLHPPzL0sAM5iyDHTPCetBcv_Sp1d-hJNQ556zVr5CdDNtNnZDeT9UXiVgAY5S64M-JSURvz-uorpDhlHE8t-NqIP0C6funSUuJTALTwKEJ_63uBUFx6mOoaK7PcASKHZ5FUs2Eanv8BS0GHxdibUAf2RceAXHkxwb2tLftSdnLjUq3WIVWvGyaOXA152k5sLcWrVPe37TXyhtlruGxJ-oGWaHmv_rm21DomcvISw5LsSS6OYGOZPVpG2uGYGgsGXwC0kLCw0NRQ_8r5isbCv0nrOWO727JWoEjEl5igJPqhucFWm0rj7fGTRzHNPtvFZjRbxEkRX6NoLHgIlI&src-supplier=Compliance+Statements; ComponentLink21URL: https://octopart.com:443/opatz8j6/c1?t=7vmJb-KgeebzF6ID3bFFwvqYryya2RktZyo-G2sT8rG6SRJyz16kOmaQ2ou6ab3xMPo5npRScceIiW07oDQ1f5JfhRkWb9_Y_6rCSDi_uNFhA6f9GIb9pNI00QkWPpkHkPf6vGHxDv5mUr8xCnFeDJMGnT5pJSW73Anww1ZNZ5YNBfaYDFRkWL08Fvbhf9VcmV8pSucmne1PHtxIs5zkCCqmelimsIXrz0uwMxahLOjitLj_9e_e1AOmWQ-ZYvwc17tVkBLVsZjK0aJCdNSugvk6xn_3gwZvuZo6Vqs_B5XwRxnkJ_GY4dJySkj0Gh5tVNccPYw3GObpftcvwec0lfkUKHKNdrMy6Lc8&src-supplier=Compliance+Statements; ComponentLink21Description: https://octopart.com:443/opatz8j6/c1?t=7vmJb-KgeebzF6ID3bFFwvqYryya2RktZyo-G2sT8rG6SRJyz16kOmaQ2ou6ab3xMPo5npRScceIiW07oDQ1f5JfhRkWb9_Y_6rCSDi_uNFhA6f9GIb9pNI00QkWPpkHkPf6vGHxDv5mUr8xCnFeDJMGnT5pJSW73Anww1ZNZ5YNBfaYDFRkWL08Fvbhf9VcmV8pSucmne1PHtxIs5zkCCqmelimsIXrz0uwMxahLOjitLj_9e_e1AOmWQ-ZYvwc17tVkBLVsZjK0aJCdNSugvk6xn_3gwZvuZo6Vqs_B5XwRxnkJ_GY4dJySkj0Gh5tVNccPYw3GObpftcvwec0lfkUKHKNdrMy6Lc8&src-supplier=Compliance+Statements; ComponentLink22URL: https://octopart.com:443/opatz8j6/c1?t=Un2tl9Nj9bSvzM7IKxJOdyIGf7L8C2-5kvYpunEZrdGSfiMO37fbS_I13rKkj5ham76OVsj54G2v97kMRcXuqb_kSMGoGiy93NryKqHZFqa8OCzokOfsjonKJ12Uuy0YHRmbezol8y4EjYZmx0TMFsWAPZBqPbeTctZo3-o-Br2JroDvYQTJwDskX6QIshJSBSA9uFUYc2RGP2Ytj2OZERSo9sD3NXytpuLuZ8C65mZ-vr0hF3yAnYySSV9fn-2l-pztLjEEm120s6sy5-svJ-xc3PuN0oLaUwllU_tTQMlPAaspxnvPl1Gpyn9Wz4Y_A71_fe4q9m_M4dKufVtGvRSOa7MFhcE&src-supplier=Compliance+Statements; ComponentLink22Description: https://octopart.com:443/opatz8j6/c1?t=Un2tl9Nj9bSvzM7IKxJOdyIGf7L8C2-5kvYpunEZrdGSfiMO37fbS_I13rKkj5ham76OVsj54G2v97kMRcXuqb_kSMGoGiy93NryKqHZFqa8OCzokOfsjonKJ12Uuy0YHRmbezol8y4EjYZmx0TMFsWAPZBqPbeTctZo3-o-Br2JroDvYQTJwDskX6QIshJSBSA9uFUYc2RGP2Ytj2OZERSo9sD3NXytpuLuZ8C65mZ-vr0hF3yAnYySSV9fn-2l-pztLjEEm120s6sy5-svJ-xc3PuN0oLaUwllU_tTQMlPAaspxnvPl1Gpyn9Wz4Y_A71_fe4q9m_M4dKufVtGvRSOa7MFhcE&src-supplier=Compliance+Statements
R1 R4 R9 R12 = RC0402FR-071ML: Res Thick Film 0402 1M Ohm 1% 0.063W(1/16W) ±100ppm/C Pad SMD T/R; Manufacturer: Yageo Group; Power Dissipation: 62.5mW; Power Rating: 63mW; Temperature Coefficient: 100ppm/°C; Voltage Rating: 50V; Supplier: Farnell; Manufacturer Part Number: RC0402FR-071ML; RoHS: Compliant; Category: Chip SMD Resistors; Stock: 1403147; Pricing: 10=10, 100=0.010, 500=0.010, 2500=0.010, 5000=0.010, 10000=0.010 (EUR); Case Code (Imperial): 0402; Case Code (Metric): 0402; China RoHS: Non-Compliant; Composition: Thick Film; Country of Origin: Mainland China, Taiwan; Depth: 500µm; Export Control Classification Number (ECCN) Code: EAR99; Height: 350µm; Harmonized Tariff Schedule (HTS) Code: 8533.21.00.30; Introduction Date: 2004-10-04; Lead Free: Lead Free; Length: 1mm; Lifecycle Status: Production; Max Operating Temperature: 155°C; Military Standard: Not; Min Operating Temperature: -55°C; Mounting Technology: Surface Mount; Pins: 2; Number of Terminals: 2; Packaging: Tape & Reel; REACH SVHC: Yes; Schedule B: 8533210045, 8533210045|8533210045|8533210045|8533210045|8533210045|8533210045|8533210045|8533210045|8533210045|8533210045|8533210045|8533210045|8533210045|8533210045|8533210045|8533210045|8533210045|8533210045|8533210045|8533210045|8533210045|8533210045|8533210045|85; Termination: SMD/SMT; Tolerance: 1%; Voltage Rating (AC): 50V; Voltage Rating (DC): 50V; Width: 500µm; Working Voltage: 50V; ComponentLink1URL: https://datasheet.octopart.com:443/RC0402FR-071ML-Yageo-datasheet-175887523.pdf?src-supplier=Newark; ComponentLink1Description: https://datasheet.octopart.com:443/RC0402FR-071ML-Yageo-datasheet-175887523.pdf?src-supplier=Newark; ComponentLink2URL: https://datasheet.octopart.com:443/RC0402FR-071ML-Yageo-Group-datasheet-190305687.pdf?src-supplier=Newark; ComponentLink2Description: https://datasheet.octopart.com:443/RC0402FR-071ML-Yageo-Group-datasheet-190305687.pdf?src-supplier=Newark; ComponentLink3URL: https://datasheet.octopart.com:443/RC0402FR-071ML-Yageo-datasheet-8324527.pdf?src-supplier=Newark; ComponentLink3Description: https://datasheet.octopart.com:443/RC0402FR-071ML-Yageo-datasheet-8324527.pdf?src-supplier=Newark; ComponentLink4URL: https://datasheet.octopart.com:443/RC0402FR-071ML-Yageo-datasheet-12531192.pdf?src-supplier=Newark; ComponentLink4Description: https://datasheet.octopart.com:443/RC0402FR-071ML-Yageo-datasheet-12531192.pdf?src-supplier=Newark; ComponentLink5URL: https://datasheet.octopart.com:443/RC0402FR-071ML-Yageo-datasheet-141265859.pdf?src-supplier=Newark; ComponentLink5Description: https://datasheet.octopart.com:443/RC0402FR-071ML-Yageo-datasheet-141265859.pdf?src-supplier=Newark; ComponentLink6URL: https://datasheet.octopart.com:443/RC0402FR-071ML-Yageo-datasheet-103092701.pdf?src-supplier=Upverter; ComponentLink6Description: https://datasheet.octopart.com:443/RC0402FR-071ML-Yageo-datasheet-103092701.pdf?src-supplier=Upverter; ComponentLink7URL: https://datasheet.octopart.com:443/RC0402FR-071ML-Yageo---Phycomp-datasheet-98239111.pdf?src-supplier=Upverter; ComponentLink7Description: https://datasheet.octopart.com:443/RC0402FR-071ML-Yageo---Phycomp-datasheet-98239111.pdf?src-supplier=Upverter; ComponentLink8URL: https://datasheet.octopart.com:443/RC0402FR-071ML-Yageo-datasheet-10408619.pdf?src-supplier=element14+APAC; ComponentLink8Description: https://datasheet.octopart.com:443/RC0402FR-071ML-Yageo-datasheet-10408619.pdf?src-supplier=element14+APAC; ComponentLink9URL: https://datasheet.octopart.com:443/RC0402FR-071ML-Yageo-datasheet-62067350.pdf?src-supplier=Farnell; ComponentLink9Description: https://datasheet.octopart.com:443/RC0402FR-071ML-Yageo-datasheet-62067350.pdf?src-supplier=Farnell; ComponentLink10URL: https://datasheet.octopart.com:443/RC0402FR-071ML-Yageo-datasheet-8329306.pdf?src-supplier=element14; ComponentLink10Description: https://datasheet.octopart.com:443/RC0402FR-071ML-Yageo-datasheet-8329306.pdf?src-supplier=element14; ComponentLink11URL: https://datasheet.octopart.com:443/RC0402FR-071ML-Yageo-Group-datasheet-176638170.pdf?src-supplier=Future+Electronics; ComponentLink11Description: https://datasheet.octopart.com:443/RC0402FR-071ML-Yageo-Group-datasheet-176638170.pdf?src-supplier=Future+Electronics; ComponentLink12URL: https://datasheet.octopart.com:443/RC0402FR-071ML-Yageo-datasheet-164759695.pdf?src-supplier=Future+Electronics; ComponentLink12Description: https://datasheet.octopart.com:443/RC0402FR-071ML-Yageo-datasheet-164759695.pdf?src-supplier=Future+Electronics; ComponentLink13URL: https://datasheet.octopart.com:443/RC0402FR-071ML-Yageo-datasheet-137700087.pdf?src-supplier=Future+Electronics; ComponentLink13Description: https://datasheet.octopart.com:443/RC0402FR-071ML-Yageo-datasheet-137700087.pdf?src-supplier=Future+Electronics; ComponentLink14URL: https://datasheet.octopart.com:443/RC0402FR-071ML-Yageo-datasheet-8324255.pdf?src-supplier=Future+Electronics; ComponentLink14Description: https://datasheet.octopart.com:443/RC0402FR-071ML-Yageo-datasheet-8324255.pdf?src-supplier=Future+Electronics; ComponentLink15URL: https://datasheet.octopart.com:443/RC0402FR-071ML-Yageo-datasheet-175423674.pdf?src-supplier=SOS+electronic; ComponentLink15Description: https://datasheet.octopart.com:443/RC0402FR-071ML-Yageo-datasheet-175423674.pdf?src-supplier=SOS+electronic; ComponentLink16URL: https://datasheet.octopart.com:443/RC0402FR-071ML-Yageo-datasheet-148775077.pdf?src-supplier=TME; ComponentLink16Description: https://datasheet.octopart.com:443/RC0402FR-071ML-Yageo-datasheet-148775077.pdf?src-supplier=TME; ComponentLink17URL: https://datasheet.octopart.com/RC0402FR-071ML-Yageo-datasheet-73766026.pdf; ComponentLink17Description: https://datasheet.octopart.com/RC0402FR-071ML-Yageo-datasheet-73766026.pdf; ComponentLink18URL: http://sigma.octopart.com:80/conflict_mineral_statement/Yageo-company-3.pdf?src-supplier=Compliance+Statements; ComponentLink18Description: http://sigma.octopart.com:80/conflict_mineral_statement/Yageo-company-3.pdf?src-supplier=Compliance+Statements; ComponentLink19URL: http://sigma.octopart.com:80/rohs_statement/Yageo-company-2.pdf?src-supplier=Compliance+Statements; ComponentLink19Description: http://sigma.octopart.com:80/rohs_statement/Yageo-company-2.pdf?src-supplier=Compliance+Statements; Supplier Part Number: RC0402FR-071ML
R2 R6 R10 R14 = CRGP2512F100K: Res Thick Film 2512 100K Ohm 1% 2W ±100ppm/°C Pad SMD T/R Automotive AEC-Q200; Manufacturer: TE Connectivity; Manufacturer Lifecycle Status: ACTIVE; Operating Supply Voltage: 500V; Supplier: Avnet; Supplier Part Number: 4-2176331-9; Manufacturer Part Number: CRGP2512F100K; RoHS: Compliant; Category: Chip SMD Resistors; Stock: 4000; Pricing: 4000=0.11838, 80000=0.11064, 160000=0.10311, 400000=0.09689, 800000=0.09638 (USD); Ambient Temperature Range High: 70°C; China RoHS: Compliant; Composition: Thick Film; Export Control Classification Number (ECCN) Code: EAR99; Height: 550µm; Harmonized Tariff Schedule (HTS) Code: 8533.21.00.30; Introduction Date: 2018-03-13; Length: 6.35mm; Lifecycle Status: Production; Max Operating Temperature: 155°C; Min Operating Temperature: -55°C; Mounting Technology: Surface Mount; Number of Terminals: 2; Packaging: Cut Tape; Power Dissipation: 2W; Power Rating: 2W; REACH SVHC: Yes; Temperature Coefficient: 100ppm/°C; Tolerance: 1%; Voltage Rating: 500V; Voltage Rating (DC): 500V; Width: 3.2mm; Working Voltage: 500V; ComponentLink1URL: https://datasheet.octopart.com:443/CRGP2512F100K-TE-Connectivity-datasheet-156004650.pdf?src-supplier=Future+Electronics; ComponentLink1Description: https://datasheet.octopart.com:443/CRGP2512F100K-TE-Connectivity-datasheet-156004650.pdf?src-supplier=Future+Electronics; ComponentLink2URL: https://datasheet.octopart.com:443/CRGP2512F100K-TE-Connectivity-datasheet-114718804.pdf?src-supplier=JRH+Electronics; ComponentLink2Description: https://datasheet.octopart.com:443/CRGP2512F100K-TE-Connectivity-datasheet-114718804.pdf?src-supplier=JRH+Electronics; ComponentLink3URL: https://datasheet.octopart.com:443/CRGP2512F100K-TE-Connectivity-datasheet-138898427.pdf?src-supplier=Upverter; ComponentLink3Description: https://datasheet.octopart.com:443/CRGP2512F100K-TE-Connectivity-datasheet-138898427.pdf?src-supplier=Upverter; ComponentLink4URL: https://sigma.octopart.com:443/114728873/technical_drawing/TE-Connectivity-CRGP2512F100K.pdf?src-supplier=TE+Connectivity; ComponentLink4Description: https://sigma.octopart.com:443/114728873/technical_drawing/TE-Connectivity-CRGP2512F100K.pdf?src-supplier=TE+Connectivity; ComponentLink5URL: https://datasheet.octopart.com:443/4-2176331-9-TE-Connectivity---AMP-datasheet-184935180.pdf?src-supplier=Master+Electronics; ComponentLink5Description: https://datasheet.octopart.com:443/4-2176331-9-TE-Connectivity---AMP-datasheet-184935180.pdf?src-supplier=Master+Electronics; ComponentLink6URL: https://datasheet.octopart.com:443/4-2176331-9-TE-Connectivity-datasheet-176339768.pdf?src-supplier=Sager+Electronics; ComponentLink6Description: https://datasheet.octopart.com:443/4-2176331-9-TE-Connectivity-datasheet-176339768.pdf?src-supplier=Sager+Electronics